# Altium project ADC_DAC2021.PrjPcb
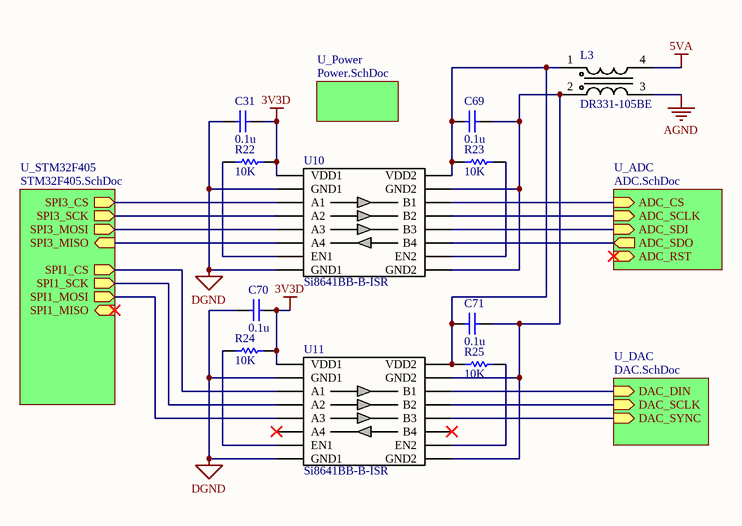
[diagram p0: top.SchDoc]
5 sheets, 182 parts. Net scope: hierarchical (ports join the sheet entries above them; power ports are global).
Board file: ADC_DAC.PcbDoc
Sheets:
  top.SchDoc
    U_ADC = ADC.SchDoc
    U_DAC = DAC.SchDoc
    U_Power = Power.SchDoc
    U_STM32F405 = STM32F405.SchDoc

## Sheet top.SchDoc
size A4

### Parts
C31  value 0.1u  [CAPC1608X90N]  (hidden comment: Cap)
C69  value 0.1u  [CAPC1608X90N]  (hidden comment: Cap)
C70  value 0.1u  [CAPC1608X90N]  (hidden comment: Cap)
C71  value 0.1u  [CAPC1608X90N]  (hidden comment: Cap)
L3  DR331-105BE  [DR331-105BE]
R22  value 10K  [RESC1608X55N]  (hidden comment: Res1)
R23  value 10K  [RESC1608X55N]  (hidden comment: Res1)
R24  value 10K  [RESC1608X55N]  (hidden comment: Res1)
R25  value 10K  [RESC1608X55N]  (hidden comment: Res1)
U10  Si8641BB-B-ISR  [SOIC127P600X175-16AN]
U11  Si8641BB-B-ISR  [SOIC127P600X175-16AN]

### Sub-sheets
U_ADC = ADC.SchDoc: ADC_SCLK (in), ADC_SDO (out), ADC_CS (in), ADC_SDI (in), ADC_RST (in)
U_DAC = DAC.SchDoc: DAC_SYNC (in), DAC_SCLK (in), DAC_DIN (in)
U_Power = Power.SchDoc: no entries
U_STM32F405 = STM32F405.SchDoc: SPI3_MOSI (out), SPI3_MISO (in), SPI3_SCK (out), SPI1_MOSI (out), SPI1_MISO (in), SPI1_SCK (out), SPI1_CS (out), SPI3_CS (out)

### Nets
3V3D: C31.1 C70.1 R22.2 R24.2 U10.1(VDD1) U11.1(VDD1)
5VA: L3.4(VOUT+)
AGND: L3.3(VOUT+)
DGND: C31.2 C70.2 U10.2(GND1) U10.8(GND1) U11.2(GND1) U11.8(GND1)
DAC_DIN: U11.14(B1) ; sheet U_DAC/DAC_DIN
DAC_SCLK: U11.13(B2) ; sheet U_DAC/DAC_SCLK
DAC_SYNC: U11.12(B3) ; sheet U_DAC/DAC_SYNC
SPI1_CS: U11.3(A1) ; sheet U_STM32F405/SPI1_CS
SPI1_MOSI: U11.5(A3) ; sheet U_STM32F405/SPI1_MOSI
SPI1_SCK: U11.4(A2) ; sheet U_STM32F405/SPI1_SCK
SPI3_CS: U10.3(A1) ; sheet U_STM32F405/SPI3_CS
SPI3_MISO: U10.6(A4) ; sheet U_STM32F405/SPI3_MISO
SPI3_MOSI: U10.5(A3) ; sheet U_STM32F405/SPI3_MOSI
SPI3_SCK: U10.4(A2) ; sheet U_STM32F405/SPI3_SCK
NetC69_1: C69.1 C71.2 L3.1(VOUT+) R23.1 R25.1 U10.16(VDD2) U11.16(VDD2)
NetC69_2: C69.2 C71.1 L3.2(VOUT+) U10.9(GND2) U10.15(GND2) U11.9(GND2) U11.15(GND2)
NetR22_1: R22.1 U10.7(EN1)
NetR23_2: R23.2 U10.10(EN2)
NetR24_1: R24.1 U11.7(EN1)
NetR25_2: R25.2 U11.10(EN2)
NetU6_1: U10.12(B3) ; sheet U_ADC/ADC_SDI
NetU6_36: U10.11(B4) ; sheet U_ADC/ADC_SDO
NetU6_37: U10.13(B2) ; sheet U_ADC/ADC_SCLK
NetU6_38: U10.14(B1) ; sheet U_ADC/ADC_CS

Not connected (* = marked no-connect by the designer): U11 6(A4)* 11(B4)*

### Library data of the parts
C31 C69-C71 = Cap: Capacitor; Published: 8-Jun-2000; LatestRevisionDate: 17-Jul-2002; LatestRevisionNote: Re-released for DXP Platform.; PackageReference: RAD-0.3; Publisher: Altium Limited; PackageDescription: Radial Cap, Thru-Hole; 2 Leads; 0.3 in Pin Spacing
L3 = DR331-105BE: Common mode choke 1mH 0.5A
R22-R25 = Res1: Resistor; Published: 8-Jun-2000; LatestRevisionDate: 17-Jul-2002; LatestRevisionNote: Re-released for DXP Platform.; PackageReference: AXIAL-0.3; Publisher: Altium Limited; PackageDescription: Axial Device, Thru-Hole; 2 Leads; 0.3 in Pin Spacing
U10 U11 = Si8641BB-B-ISR: isolator for SPI 3 forward 1 reverse isolator

## Sheet ADC.SchDoc
size A4
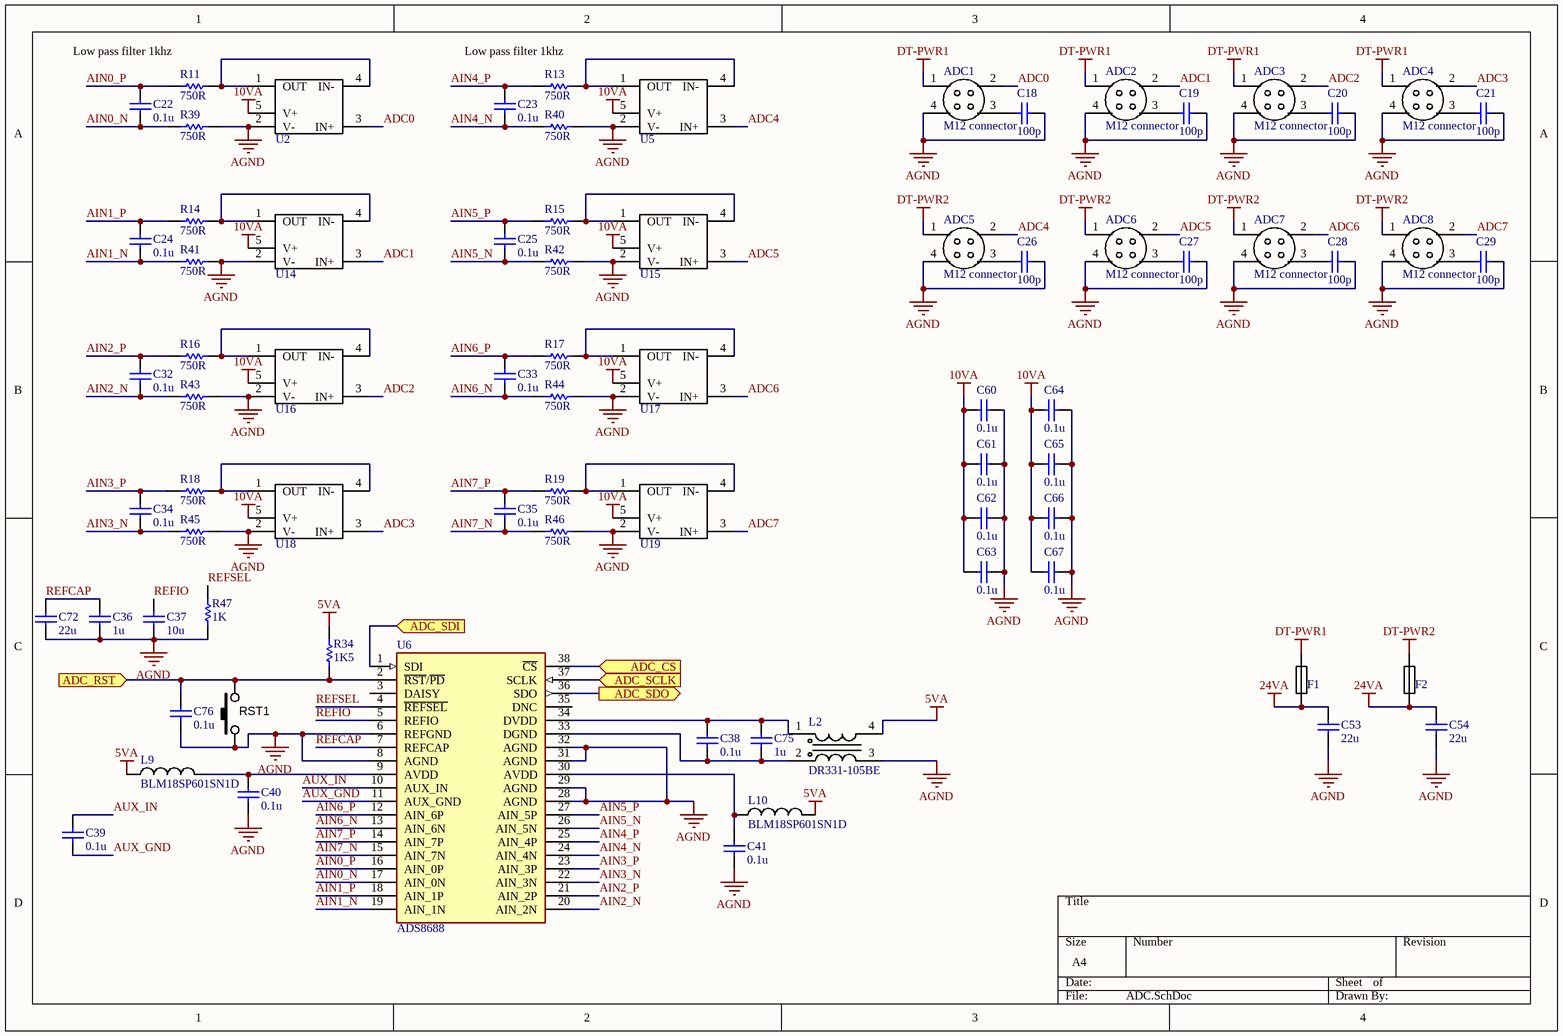
[diagram p1: ADC.SchDoc]

### Parts
ADC1  M12 connector  [GX12_PCB_Mount]
ADC2  M12 connector  [GX12_PCB_Mount]
ADC3  M12 connector  [GX12_PCB_Mount]
ADC4  M12 connector  [GX12_PCB_Mount]
ADC5  M12 connector  [GX12_PCB_Mount]
ADC6  M12 connector  [GX12_PCB_Mount]
ADC7  M12 connector  [GX12_PCB_Mount]
ADC8  M12 connector  [GX12_PCB_Mount]
C18  value 100p  [CAPC1608X90N]  (hidden comment: Cap)
C19  value 100p  [CAPC1608X90N]  (hidden comment: Cap)
C20  value 100p  [CAPC1608X90N]  (hidden comment: Cap)
C21  value 100p  [CAPC1608X90N]  (hidden comment: Cap)
C22  value 0.1u  [CAPC1608X90N]  (hidden comment: Cap)
C23  value 0.1u  [CAPC1608X90N]  (hidden comment: Cap)
C24  value 0.1u  [CAPC1608X90N]  (hidden comment: Cap)
C25  value 0.1u  [CAPC1608X90N]  (hidden comment: Cap)
C26  value 100p  [CAPC1608X90N]  (hidden comment: Cap)
C27  value 100p  [CAPC1608X90N]  (hidden comment: Cap)
C28  value 100p  [CAPC1608X90N]  (hidden comment: Cap)
C29  value 100p  [CAPC1608X90N]  (hidden comment: Cap)
C32  value 0.1u  [CAPC1608X90N]  (hidden comment: Cap)
C33  value 0.1u  [CAPC1608X90N]  (hidden comment: Cap)
C34  value 0.1u  [CAPC1608X90N]  (hidden comment: Cap)
C35  value 0.1u  [CAPC1608X90N]  (hidden comment: Cap)
C36  value 1u  [CAPC1608X90N]  (hidden comment: Cap)
C37  value 10u  [CAPC1608X90N]  (hidden comment: Cap)
C38  value 0.1u  [CAPC1608X90N]  (hidden comment: Cap)
C39  value 0.1u  [CAPC1608X90N]  (hidden comment: Cap)
C40  value 0.1u  [CAPC1608X90N]  (hidden comment: Cap)
C41  value 0.1u  [CAPC1608X90N]  (hidden comment: Cap)
C53  value 22u  [CAPC2012X135N]  (hidden comment: Cap)
C54  value 22u  [CAPC2012X135N]  (hidden comment: Cap)
C60  value 0.1u  [CAPC1608X90N]  (hidden comment: Cap)
C61  value 0.1u  [CAPC1608X90N]  (hidden comment: Cap)
C62  value 0.1u  [CAPC1608X90N]  (hidden comment: Cap)
C63  value 0.1u  [CAPC1608X90N]  (hidden comment: Cap)
C64  value 0.1u  [CAPC1608X90N]  (hidden comment: Cap)
C65  value 0.1u  [CAPC1608X90N]  (hidden comment: Cap)
C66  value 0.1u  [CAPC1608X90N]  (hidden comment: Cap)
C67  value 0.1u  [CAPC1608X90N]  (hidden comment: Cap)
C72  value 22u  [CAPC2012X135N]  (hidden comment: Cap)
C75  value 1u  [CAPC1608X90N]  (hidden comment: Cap)
C76  value 0.1u  [CAPC1608X90N]  (hidden comment: Cap)
F1  MFU0805FF00500P100  [RESC2012X70N]  (value not drawn)
F2  MFU0805FF00500P100  [RESC2012X70N]  (value not drawn)
L2  DR331-105BE  [DR331-105BE]
L9  BLM18SP601SN1D  [INDC1608N]
L10  BLM18SP601SN1D  [INDC1608N]
R11  value 750R  [RESC1608X55N]  (hidden comment: Res1)
R13  value 750R  [RESC1608X55N]  (hidden comment: Res1)
R14  value 750R  [RESC1608X55N]  (hidden comment: Res1)
R15  value 750R  [RESC1608X55N]  (hidden comment: Res1)
R16  value 750R  [RESC1608X55N]  (hidden comment: Res1)
R17  value 750R  [RESC1608X55N]  (hidden comment: Res1)
R18  value 750R  [RESC1608X55N]  (hidden comment: Res1)
R19  value 750R  [RESC1608X55N]  (hidden comment: Res1)
R34  value 1K5  [RESC1608X55N]  (hidden comment: Res1)
R39  value 750R  [RESC1608X55N]  (hidden comment: Res1)
R40  value 750R  [RESC1608X55N]  (hidden comment: Res1)
R41  value 750R  [RESC1608X55N]  (hidden comment: Res1)
R42  value 750R  [RESC1608X55N]  (hidden comment: Res1)
R43  value 750R  [RESC1608X55N]  (hidden comment: Res1)
R44  value 750R  [RESC1608X55N]  (hidden comment: Res1)
R45  value 750R  [RESC1608X55N]  (hidden comment: Res1)
R46  value 750R  [RESC1608X55N]  (hidden comment: Res1)
R47  value 1K  [RESC1608X55N]  (hidden comment: Res1)
RST1  SW_THT_PB_4.3mm  [TACT_SWT-SMD-4.4]  (value not drawn)
U2  OPA196  [SOT23-5]  (value not drawn)
U5  OPA196  [SOT23-5]  (value not drawn)
U6  ADS8688  [TSSOP38]
U14  OPA196  [SOT23-5]  (value not drawn)
U15  OPA196  [SOT23-5]  (value not drawn)
U16  OPA196  [SOT23-5]  (value not drawn)
U17  OPA196  [SOT23-5]  (value not drawn)
U18  OPA196  [SOT23-5]  (value not drawn)
U19  OPA196  [SOT23-5]  (value not drawn)

### Ports
ADC_CS (in), ADC_RST (in), ADC_SCLK (in), ADC_SDI (in), ADC_SDO (out)

### Nets
5VA: L2.4(VOUT+) L9.1 L10.2 R34.2
10VA: C60.2 C61.2 C62.2 C63.2 C64.2 C65.2 C66.2 C67.2 U2.5(V+) U5.5(V+) U14.5(V+) U15.5(V+) U16.5(V+) U17.5(V+) U18.5(V+) U19.5(V+)
24VA: C53.2 C54.2 F1.1 F2.1
AGND: ADC1.4 ADC2.4 ADC3.4 ADC4.4 ADC5.4 ADC6.4 ADC7.4 ADC8.4 C18.1 C19.1 C20.1 C21.1 C26.1 C27.1 C28.1 C29.1 C36.1 C37.1 C40.1 C41.1 C53.1 C54.1 C60.1 C61.1 C62.1 C63.1 C64.1 C65.1 C66.1 C67.1 C72.1 C76.2 L2.3(VOUT+) R39.2 R40.2 R41.2 R42.2 R43.2 R44.2 R45.2 R46.2 R47.1 RST1.1 U2.2(V-) U5.2(V-) U6.6(REFGND) U6.8(AGND) U6.28(AGND) U6.29(AGND) U6.31(AGND) U6.32(AGND) U14.2(V-) U15.2(V-) U16.2(V-) U17.2(V-) U18.2(V-) U19.2(V-)
DT-PWR1: ADC1.1 ADC2.1 ADC3.1 ADC4.1 F1.2
DT-PWR2: ADC5.1 ADC6.1 ADC7.1 ADC8.1 F2.2
ADC0: ADC1.2 U2.3(IN+)
ADC1: ADC2.2 U14.3(IN+)
ADC2: ADC3.2 U16.3(IN+)
ADC3: ADC4.2 U18.3(IN+)
ADC4: ADC5.2 U5.3(IN+)
ADC5: ADC6.2 U15.3(IN+)
ADC6: ADC7.2 U17.3(IN+)
ADC7: ADC8.2 U19.3(IN+)
AIN0_N: C22.1 R39.1 U6.17(AIN_0N)
AIN0_P: C22.2 R11.1 U6.16(AIN_0P)
AIN1_N: C24.1 R41.1 U6.19(AIN_1N)
AIN1_P: C24.2 R14.1 U6.18(AIN_1P)
AIN2_N: C32.1 R43.1 U6.20(AIN_2N)
AIN2_P: C32.2 R16.1 U6.21(AIN_2P)
AIN3_N: C34.1 R45.1 U6.22(AIN_3N)
AIN3_P: C34.2 R18.1 U6.23(AIN_3P)
AIN4_N: C23.1 R40.1 U6.24(AIN_4N)
AIN4_P: C23.2 R13.1 U6.25(AIN_4P)
AIN5_N: C25.1 R42.1 U6.26(AIN_5N)
AIN5_P: C25.2 R15.1 U6.27(AIN_5P)
AIN6_N: C33.1 R44.1 U6.13(AIN_6N)
AIN6_P: C33.2 R17.1 U6.12(AIN_6P)
AIN7_N: C35.1 R46.1 U6.15(AIN_7N)
AIN7_P: C35.2 R19.1 U6.14(AIN_7P)
AUX_GND: C39.1 U6.11(AUX_GND)
AUX_IN: C39.2 U6.10(AUX_IN)
REFCAP: C36.2 C72.2 U6.7(REFCAP)
REFIO: C37.2 U6.5(REFIO)
REFSEL: R47.2 U6.4(~{REFSEL})
NetADC1_3: ADC1.3 C18.2
NetADC2_3: ADC2.3 C19.2
NetADC3_3: ADC3.3 C20.2
NetADC4_3: ADC4.3 C21.2
NetADC5_3: ADC5.3 C26.2
NetADC6_3: ADC6.3 C27.2
NetADC7_3: ADC7.3 C28.2
NetADC8_3: ADC8.3 C29.2
NetC38_1: C38.1 C75.1 L2.2(VOUT+) U6.33(DGND)
NetC38_2: C38.2 C75.2 L2.1(VOUT+) U6.34(DVDD)
NetC40_2: C40.2 L9.2 U6.9(AVDD)
NetC41_2: C41.2 L10.1 U6.30(AVDD)
NetC76_1: C76.1 R34.1 RST1.2 U6.2(~{RST}/~{PD}) ; port ADC_RST
NetR11_2: R11.2 U2.1(OUT) U2.4(IN-)
NetR13_2: R13.2 U5.1(OUT) U5.4(IN-)
NetR14_2: R14.2 U14.1(OUT) U14.4(IN-)
NetR15_2: R15.2 U15.1(OUT) U15.4(IN-)
NetR16_2: R16.2 U16.1(OUT) U16.4(IN-)
NetR17_2: R17.2 U17.1(OUT) U17.4(IN-)
NetR18_2: R18.2 U18.1(OUT) U18.4(IN-)
NetR19_2: R19.2 U19.1(OUT) U19.4(IN-)
NetU6_1: U6.1(SDI) ; port ADC_SDI
NetU6_36: U6.36(SDO) ; port ADC_SDO
NetU6_37: U6.37(SCLK) ; port ADC_SCLK
NetU6_38: U6.38(~{CS}) ; port ADC_CS

Not connected (* = marked no-connect by the designer): U6 3(DAISY) 35(DNC)

### Notes on the sheet
- Low pass filter 1khz

### Library data of the parts
ADC1-ADC8 = M12_connector: M12 connect with 4 pin, current 4A per terminal; ComponentLink1Description: Purchase; ComponentLink1URL: https://item.taobao.com/item.htm?spm=a230r.1.14.42.72f34373kzOCRP&id=571188244354&ns=1&abbucket=18#detail
C18-C29 C32-C41 C53 C54 C60-C67 C72 C75 C76 = Cap: Capacitor; Published: 8-Jun-2000; LatestRevisionDate: 17-Jul-2002; LatestRevisionNote: Re-released for DXP Platform.; PackageReference: RAD-0.3; Publisher: Altium Limited; PackageDescription: Radial Cap, Thru-Hole; 2 Leads; 0.3 in Pin Spacing
F1 F2 = FUSE_32V_500MA_0805: fuse 32V 0.5A
L2 = DR331-105BE: Common mode choke 1mH 0.5A
L9 L10 = INC_BLM18SP601SN1D: Ferritebead 1.5A, max 600ohm resistance
R11 R13-R19 R34 R39-R47 = Res1: Resistor; Published: 8-Jun-2000; LatestRevisionDate: 17-Jul-2002; LatestRevisionNote: Re-released for DXP Platform.; PackageReference: AXIAL-0.3; Publisher: Altium Limited; PackageDescription: Axial Device, Thru-Hole; 2 Leads; 0.3 in Pin Spacing
RST1 = SW_THT_PB_4.3mm: Switch, tact, 4.3mm stem; Manufacturer 1: Bond-Tact; Manufacturer Part Number 1: TS-1143-WP-300; SCDType: spec; Function: Speed; Package / Case: 6.5x6.5mm; 4.3mm stem; Material: Brass/Nylon/Ag plating
U2 U5 U14-U19 = OPA196: operational amplifier 36V input; Vs: -16 to +16 / 0 to 36V; Offset voltage: 100uV; Iout: -65 to 65mA; ComponentLink1Description: datasheet; ComponentLink1URL: https://www.ti.com/lit/ds/symlink/opa196.pdf?HQS=TI-null-null-mousermode-df-pf-null-wwe&DCM=yes&ref_url=https%3A%2F%2Fwww.mouser.hk%2F&distId=26
U6 = ADS8688: ADC 8 channel, 500KSPS

## Sheet DAC.SchDoc
size A4
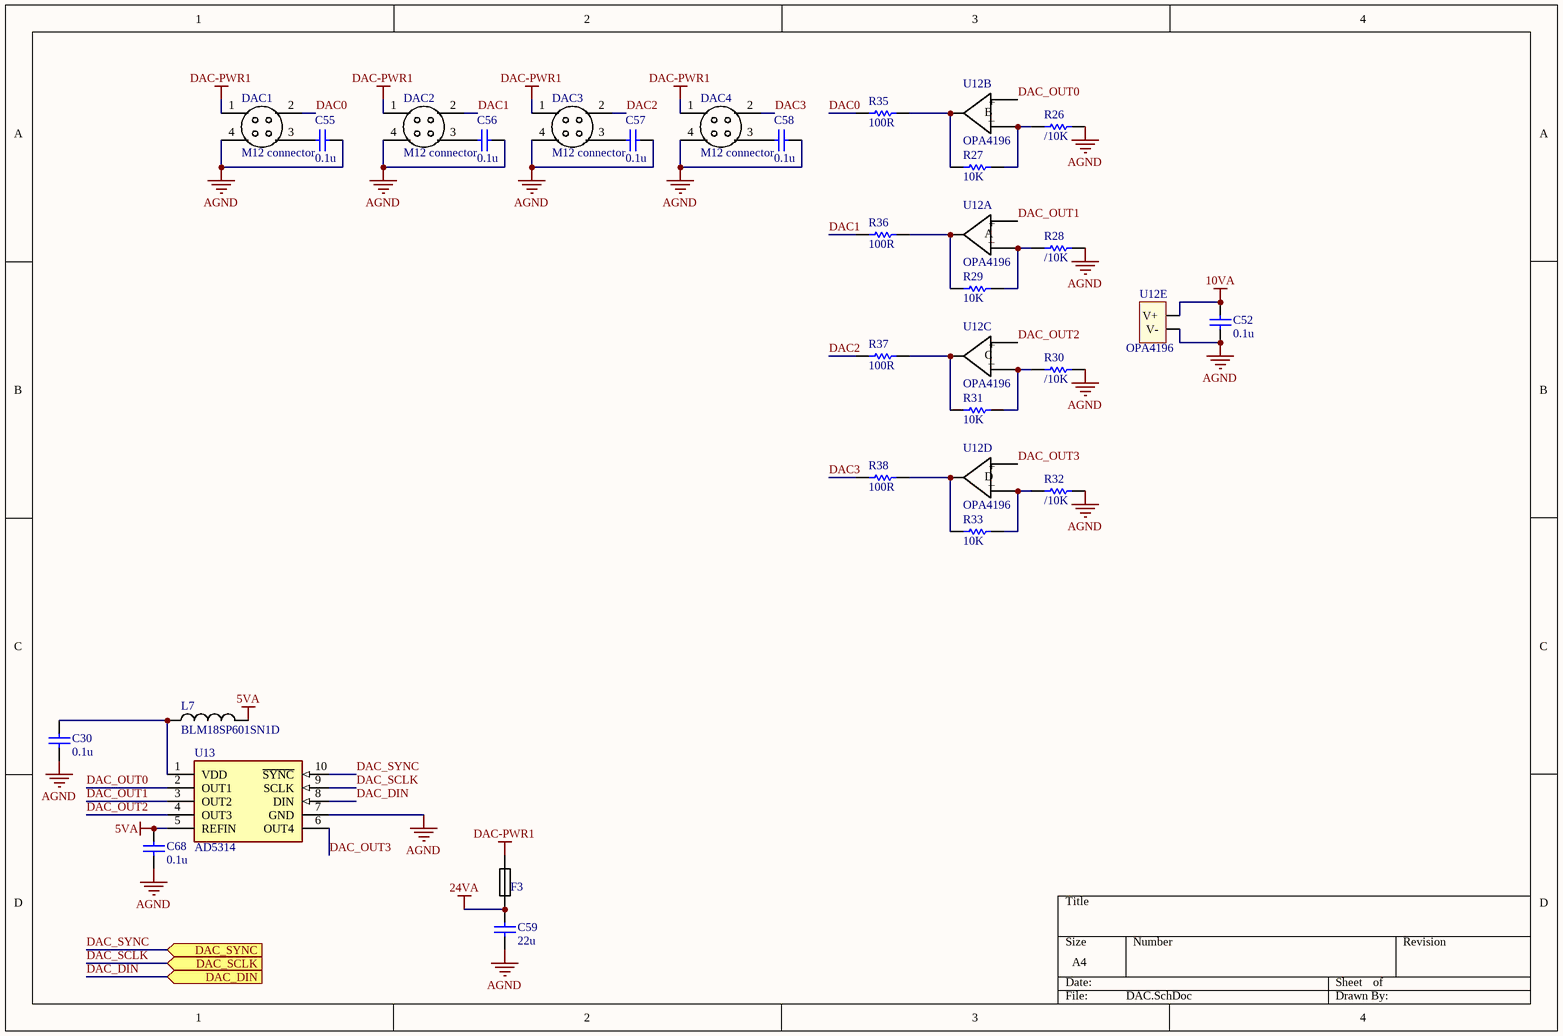
[diagram p2: DAC.SchDoc]

### Parts
C30  value 0.1u  [CAPC1608X90N]  (hidden comment: Cap)
C52  value 0.1u  [CAPC1608X90N]  (hidden comment: Cap)
C55  value 0.1u  [CAPC1608X90N]  (hidden comment: Cap)
C56  value 0.1u  [CAPC1608X90N]  (hidden comment: Cap)
C57  value 0.1u  [CAPC1608X90N]  (hidden comment: Cap)
C58  value 0.1u  [CAPC1608X90N]  (hidden comment: Cap)
C59  value 22u  [CAPC2012X135N]  (hidden comment: Cap)
C68  value 0.1u  [CAPC1608X90N]  (hidden comment: Cap)
DAC1  M12 connector  [GX12_PCB_Mount]
DAC2  M12 connector  [GX12_PCB_Mount]
DAC3  M12 connector  [GX12_PCB_Mount]
DAC4  M12 connector  [GX12_PCB_Mount]
F3  MFU0805FF00500P100  [RESC2012X70N]  (value not drawn)
L7  BLM18SP601SN1D  [INDC1608N]
R26  value /10K  [RESC1608X55N]  (hidden comment: Res1)
R27  value 10K  [RESC1608X55N]  (hidden comment: Res1)
R28  value /10K  [RESC1608X55N]  (hidden comment: Res1)
R29  value 10K  [RESC1608X55N]  (hidden comment: Res1)
R30  value /10K  [RESC1608X55N]  (hidden comment: Res1)
R31  value 10K  [RESC1608X55N]  (hidden comment: Res1)
R32  value /10K  [RESC1608X55N]  (hidden comment: Res1)
R33  value 10K  [RESC1608X55N]  (hidden comment: Res1)
R35  value 100R  [RESC1608X55N]  (hidden comment: Res1)
R36  value 100R  [RESC1608X55N]  (hidden comment: Res1)
R37  value 100R  [RESC1608X55N]  (hidden comment: Res1)
R38  value 100R  [RESC1608X55N]  (hidden comment: Res1)
U12  OPA4196  [SOIC127P600X175-14AN]  (parts A,B,C,D,E of 5)
U13  AD5314  [MSOP10_no_EP]

### Ports
DAC_DIN (in), DAC_SCLK (in), DAC_SYNC (in)

### Nets
5VA: C68.1 L7.1 U13.5(REFIN)
10VA: C52.1 U12.4(V+)
24VA: C59.2 F3.1
AGND: C30.2 C52.2 C55.1 C56.1 C57.1 C58.1 C59.1 C68.2 DAC1.4 DAC2.4 DAC3.4 DAC4.4 R26.2 R28.2 R30.2 R32.2 U12.11(V-) U13.7(GND)
DAC-PWR1: DAC1.1 DAC2.1 DAC3.1 DAC4.1 F3.2
DAC0: DAC1.2 R35.1
DAC1: DAC2.2 R36.1
DAC2: DAC3.2 R37.1
DAC3: DAC4.2 R38.1
DAC_DIN: U13.8(DIN) ; port DAC_DIN
DAC_OUT0: U12.5(INB+) U13.2(OUT1)
DAC_OUT1: U12.3(INA+) U13.3(OUT2)
DAC_OUT2: U12.10(INC+) U13.4(OUT3)
DAC_OUT3: U12.12(IND+) U13.6(OUT4)
DAC_SCLK: U13.9(SCLK) ; port DAC_SCLK
DAC_SYNC: U13.10(~{SYNC}) ; port DAC_SYNC
NetC30_1: C30.1 L7.2 U13.1(VDD)
NetC55_2: C55.2 DAC1.3
NetC56_2: C56.2 DAC2.3
NetC57_2: C57.2 DAC3.3
NetC58_2: C58.2 DAC4.3
NetR26_1: R26.1 R27.2 U12.6(INB-)
NetR27_1: R27.1 R35.2 U12.7(OUT_B)
NetR28_1: R28.1 R29.2 U12.2(INA-)
NetR29_1: R29.1 R36.2 U12.1(OUT_A)
NetR30_1: R30.1 R31.2 U12.9(INC-)
NetR31_1: R31.1 R37.2 U12.8(OUT_C)
NetR32_1: R32.1 R33.2 U12.13(IND-)
NetR33_1: R33.1 R38.2 U12.14(OUT_D)

### Notes on the sheet
- (in symbol OPA4196, part A) +; A; _
- (in symbol OPA4196, part B) +; B; _
- (in symbol OPA4196, part C) +; C; _
- (in symbol OPA4196, part D) +; D; _

### Library data of the parts
C30 C52 C55-C59 C68 = Cap: Capacitor; Published: 8-Jun-2000; LatestRevisionDate: 17-Jul-2002; LatestRevisionNote: Re-released for DXP Platform.; PackageReference: RAD-0.3; Publisher: Altium Limited; PackageDescription: Radial Cap, Thru-Hole; 2 Leads; 0.3 in Pin Spacing
DAC1-DAC4 = M12_connector: as ADC1 on sheet ADC; ComponentLink1Description: Purchase; ComponentLink1URL: https://item.taobao.com/item.htm?spm=a230r.1.14.42.72f34373kzOCRP&id=571188244354&ns=1&abbucket=18#detail
F3 = FUSE_32V_500MA_0805: fuse 32V 0.5A
L7 = INC_BLM18SP601SN1D: Ferritebead 1.5A, max 600ohm resistance
R26-R33 R35-R38 = Res1: Resistor; Published: 8-Jun-2000; LatestRevisionDate: 17-Jul-2002; LatestRevisionNote: Re-released for DXP Platform.; PackageReference: AXIAL-0.3; Publisher: Altium Limited; PackageDescription: Axial Device, Thru-Hole; 2 Leads; 0.3 in Pin Spacing
U12 = OPA4196: operational amplifier 36V input
U13 = AD5314: 10-bit DAC 4 channel

## Sheet Power.SchDoc
size A4
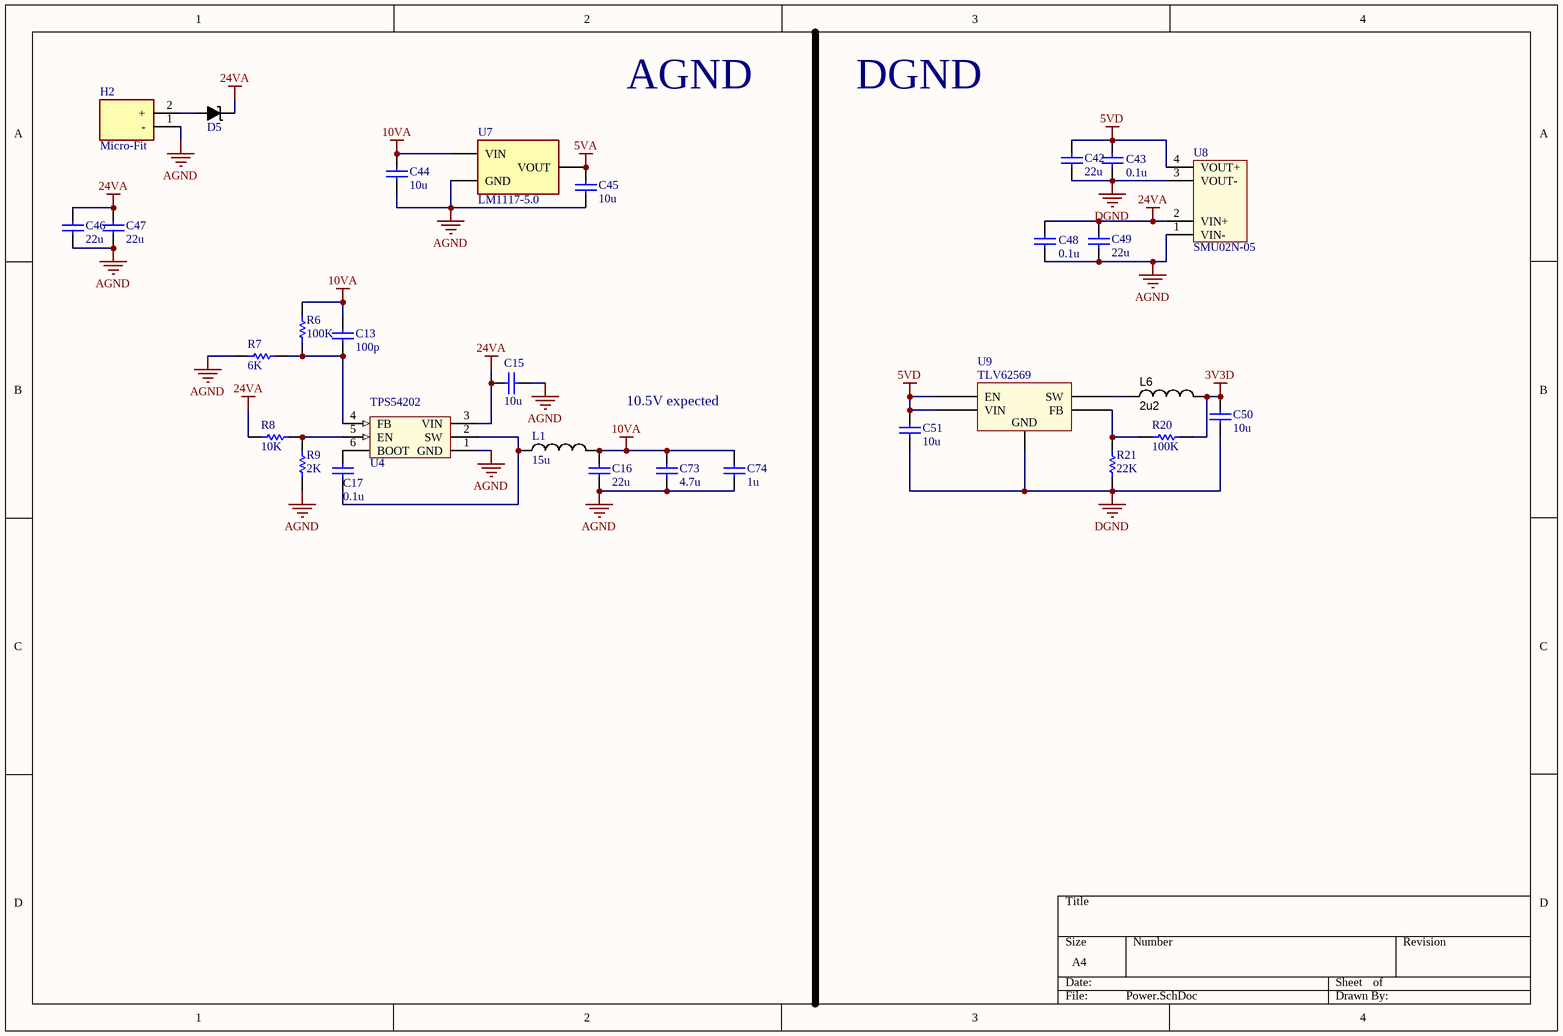
[diagram p3: Power.SchDoc]

### Parts
C13  value 100p  [CAPC1608X90N]  (hidden comment: Cap)
C15  value 10u  [CAPC2012X135N]  (hidden comment: Cap)
C16  value 22u  [CAPC2012X135N]  (hidden comment: Cap)
C17  value 0.1u  [CAPC1608X90N]  (hidden comment: Cap)
C42  value 22u  [CAPC2012X135N]  (hidden comment: Cap)
C43  value 0.1u  [CAPC1608X90N]  (hidden comment: Cap)
C44  value 10u  [CAPC2012X135N]  (hidden comment: Cap)
C45  value 10u  [CAPC2012X135N]  (hidden comment: Cap)
C46  value 22u  [CAPC2012X135N]  (hidden comment: Cap)
C47  value 22u  [CAPC2012X135N]  (hidden comment: Cap)
C48  value 0.1u  [CAPC1608X90N]  (hidden comment: Cap)
C49  value 22u  [CAPC2012X135N]  (hidden comment: Cap)
C50  value 10u  [CAPC2012X135N]  (hidden comment: Cap)
C51  value 10u  [CAPC2012X135N]  (hidden comment: Cap)
C73  value 4.7u  [CAPC1608X90N]  (hidden comment: Cap)
C74  value 1u  [CAPC1608X90N]  (hidden comment: Cap)
D5  SS24  [DO-214AA]  (value not drawn)
H2  Micro-Fit  [430450212]
L1  value 15u  [INDC_5.5x5.3x3]  (hidden comment: 15uH inductor)
L6  value 2u2  [INDM3225X240N]  (hidden comment: inductor)
R6  value 100K  [RESC1608X55N]  (hidden comment: Res1)
R7  value 6K  [RESC1608X55N]  (hidden comment: Res1)
R8  value 10K  [RESC1608X55N]  (hidden comment: Res1)
R9  value 2K  [RESC1608X55N]  (hidden comment: Res1)
R20  value 100K  [RESC2012X70N]  (hidden comment: Res1)
R21  value 22K  [RESC2012X70N]  (hidden comment: Res1)
U4  TPS54202  [SOT23-6]
U7  LM1117-5.0  [SOT223]
U8  SMU02N-05  [SMU02N]
U9  TLV62569  [SOT23-5]

### Nets
3V3D: C50.2 L6.2 R20.1
5VA: C45.2 U7.2(VOUT) U7.4(VOUT)
5VD: C42.2 C43.2 C51.2 U8.4(VOUT+) U9.1(EN) U9.4(VIN)
10VA: C13.2 C16.2 C44.2 C73.2 C74.2 L1.2 R6.2 U7.3(VIN)
24VA: C15.1 C46.2 C47.2 C48.2 C49.2 D5.K(Cathode) R8.1 U4.3(VIN) U8.2(VIN+)
AGND: C15.2 C16.1 C44.1 C45.1 C46.1 C47.1 C48.1 C49.1 C73.1 C74.1 H2.1(-) R7.2 R9.1 U4.1(GND) U7.1(GND) U8.1(VIN-)
DGND: C42.1 C43.1 C50.1 C51.1 R21.2 U8.3(VOUT-) U9.2(GND)
NetC13_1: C13.1 R6.1 R7.1 U4.4(FB)
NetC17_1: C17.1 L1.1 U4.2(SW)
NetC17_2: C17.2 U4.6(BOOT)
NetD5_A: D5.A(Anode) H2.2(+)
NetL6_1: L6.1 U9.3(SW)
NetR8_2: R8.2 R9.2 U4.5(EN)
NetR20_2: R20.2 R21.1 U9.5(FB)

### Notes on the sheet
- AGND
- DGND
- 10.5V expected

### Library data of the parts
C13 C15-C17 C42-C51 C73 C74 = Cap: Capacitor; Published: 8-Jun-2000; LatestRevisionDate: 17-Jul-2002; LatestRevisionNote: Re-released for DXP Platform.; PackageReference: RAD-0.3; Publisher: Altium Limited; PackageDescription: Radial Cap, Thru-Hole; 2 Leads; 0.3 in Pin Spacing
D5 = SS24: 2.0A SURFACE MOUNT SCHOTTKY BARRIER RECTIFIER; Voltage: 40V; Current: 2A
H2 = Molex_430450212: Micro fit series from MOLEX. 2P. 8.6A
L1 = INDC_MPX1D0530L150: 15uH inductor with 2A saturation current. Dimension is 5.5 * 5.2 * 3 mm^3; Saturation Current: 2A
L6 = INDC: IHLP SMD 4040; link: http://www.mouser.hk/ProductDetail/Panasonic/ETQ-P5M4R7YFC/?qs=sGAEpiMZZMsg%252by3WlYCkUx1BJssUTVH58rrEHsPkNus%3d
R6-R9 R20 R21 = Res1: Resistor; Published: 8-Jun-2000; LatestRevisionDate: 17-Jul-2002; LatestRevisionNote: Re-released for DXP Platform.; PackageReference: AXIAL-0.3; Publisher: Altium Limited; PackageDescription: Axial Device, Thru-Hole; 2 Leads; 0.3 in Pin Spacing
U4 = TPS54202: 4.5-28V input 2A output step down, EMI Friendly Synchronous Step Down Converter; Vin(max): 28V; Vin(min): 4.5V; Currrent: 2A
U7 = LM1117-5.0: 1117 LDO with fixed 5V output, 800mA current
U8 = SMU02N-05: isolated 24V to 5V
U9 = TLV62569: 2-A High Efficiency Synchronous Buck Converter in SOT Package; Manufacturer: TI; Vin: 2.5-5.5V; Iout(max): 2A

## Sheet STM32F405.SchDoc
size A4
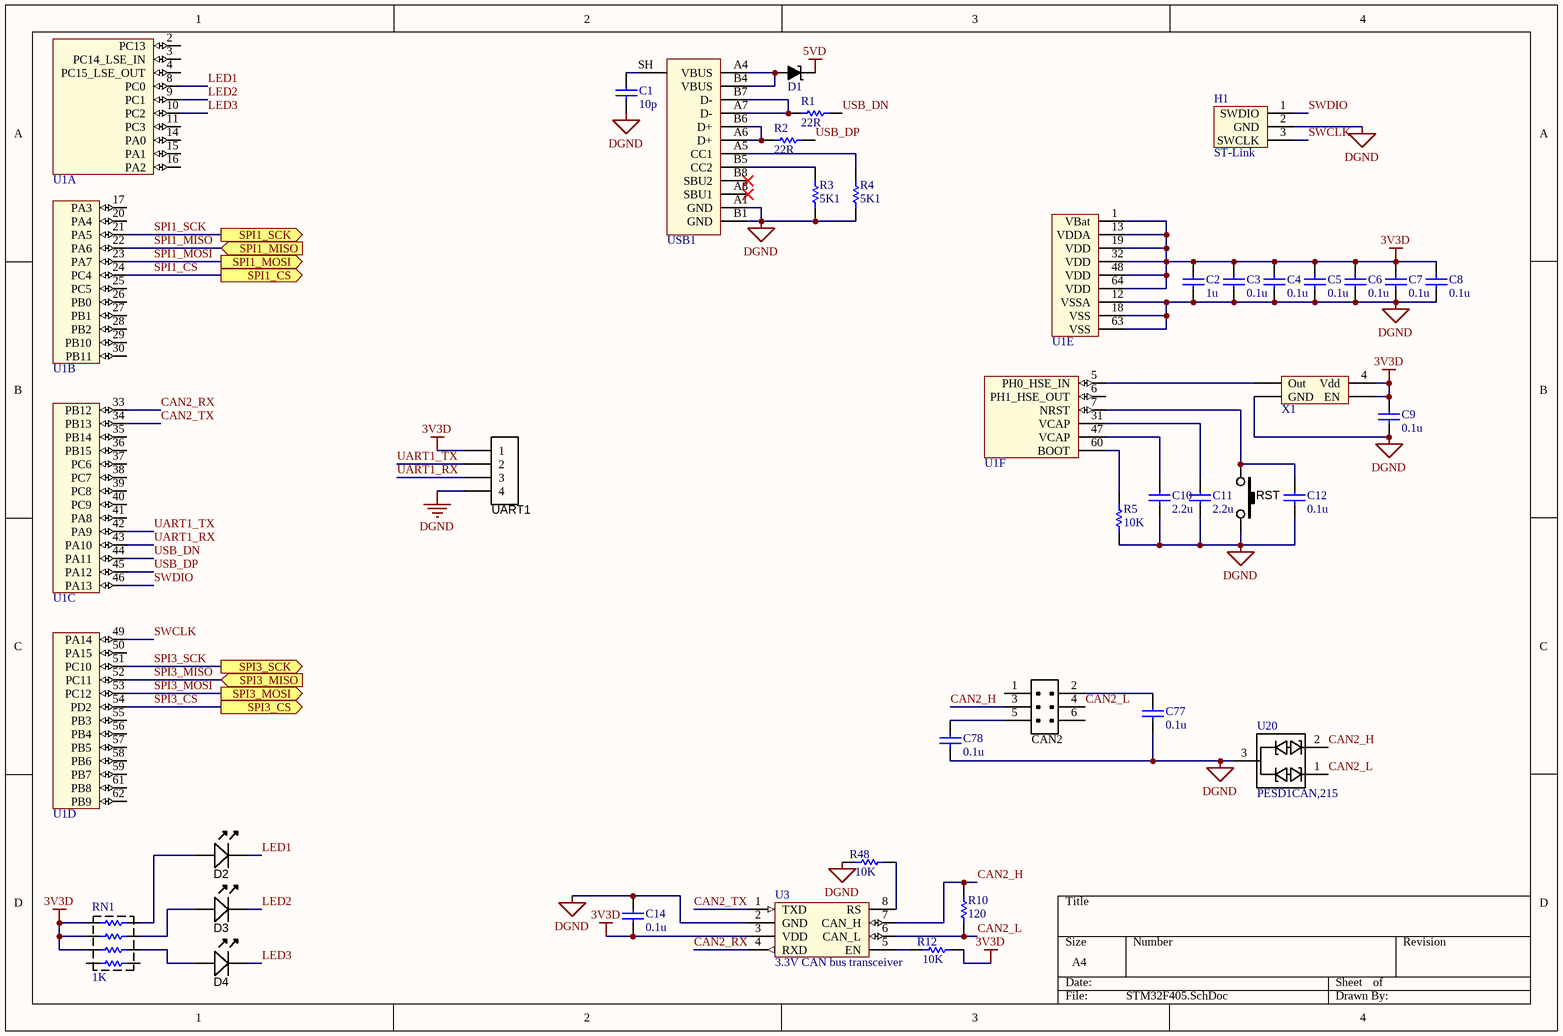
[diagram p4: STM32F405.SchDoc]

### Parts
C1  value 10p  [CAPC1608X90N]  (hidden comment: Cap)
C2  value 1u  [CAPC1608X90N]  (hidden comment: Cap)
C3  value 0.1u  [CAPC1608X90N]  (hidden comment: Cap)
C4  value 0.1u  [CAPC1608X90N]  (hidden comment: Cap)
C5  value 0.1u  [CAPC1608X90N]  (hidden comment: Cap)
C6  value 0.1u  [CAPC1608X90N]  (hidden comment: Cap)
C7  value 0.1u  [CAPC1608X90N]  (hidden comment: Cap)
C8  value 0.1u  [CAPC1608X90N]  (hidden comment: Cap)
C9  value 0.1u  [CAPC1608X90N]  (hidden comment: Cap)
C10  value 2.2u  [CAPC1608X90N]  (hidden comment: Cap)
C11  value 2.2u  [CAPC1608X90N]  (hidden comment: Cap)
C12  value 0.1u  [CAPC1608X90N]  (hidden comment: Cap)
C14  value 0.1u  [CAPC1608X90N]  (hidden comment: Cap)
C77  value 0.1u  [CAPC1608X90N]  (hidden comment: Cap)
C78  value 0.1u  [CAPC1608X90N]  (hidden comment: Cap)
CAN2  Header, 2x3-pin  [HDR2X3_2.54MMP_RA]  (value not drawn)
D1  diode  [DIODE_3216_70N]  (value not drawn)
D2  LED_Green_GullWing  [LED-0805-A]  (value not drawn)
D3  LED_Green_GullWing  [LED-0805-A]  (value not drawn)
D4  LED_Green_GullWing  [LED-0805-A]  (value not drawn)
H1  ST-Link  [ST-Link]
R1  value 22R  [RESC1608X55N]  (hidden comment: Res1)
R2  value 22R  [RESC1608X55N]  (hidden comment: Res1)
R3  value 5K1  [RESC1608X55N]  (hidden comment: Res1)
R4  value 5K1  [RESC1608X55N]  (hidden comment: Res1)
R5  value 10K  [RESC1608X55N]  (hidden comment: Res1)
R10  value 120  [RESC1608X55N]  (hidden comment: Res1)
R12  value 10K  [RESC1608X55N]  (hidden comment: Res1)
R48  value 10K  [RESC1608X55N]  (hidden comment: Res1)
RN1  value 1K  [RESCAXS50P160X320X70-8N]  (hidden comment: resistor network)
RST  SW_THT_PB_4.3mm  [TACT_SWT-SMD-4.4]  (value not drawn)
U1  STM32F405RE  [LQFP64]  (value not drawn)  (parts A,B,C,D,E,F of 6)
U3  3.3V CAN bus transceiver  [SOIC127P600X175-8AN]
U20  PESD1CAN,215  [SOT23-3]
UART1  Programmer  [HDR1X4_2.54MMP]  (value not drawn)  (no BOM)
USB1  USB type C connector  [TYPE-C-31-M-12]  (value not drawn)
X1  ASE-8.000MHZ-LC-T  [ASE Series]  (value not drawn)

### Ports
SPI1_CS (out), SPI1_MISO (in), SPI1_MOSI (out), SPI1_SCK (out), SPI3_CS (out), SPI3_MISO (in), SPI3_MOSI (out), SPI3_SCK (out)

### Nets
3V3D: C2.2 C3.2 C4.2 C5.2 C6.2 C7.2 C8.2 C9.2 C14.1 R12.1 RN1.1 RN1.2 RN1.3 U1.1(VBat) U1.13(VDDA) U1.19(VDD) U1.32(VDD) U1.48(VDD) U1.64(VDD) U3.3(VDD) UART1.1 X1.1(EN) X1.4(Vdd)
5VD: D1.K(Cathode)
DGND: C1.1 C2.1 C3.1 C4.1 C5.1 C6.1 C7.1 C8.1 C9.1 C10.1 C11.1 C12.1 C14.2 C77.2 C78.1 H1.2(GND) R3.1 R4.1 R5.1 R48.2 RST.2 U1.12(VSSA) U1.18(VSS) U1.63(VSS) U3.2(GND) U20.3 UART1.4 USB1.A1(GND) USB1.B1(GND) X1.2(GND)
CAN2_H: CAN2.3 R10.2 U3.7(CAN_H) U20.2
CAN2_L: CAN2.4 R10.1 U3.6(CAN_L) U20.1
CAN2_RX: U1.33(PB12) U3.4(RXD)
CAN2_TX: U1.34(PB13) U3.1(TXD)
LED1: D2.K U1.8(PC0)
LED2: D3.K U1.9(PC1)
LED3: D4.K U1.10(PC2)
SPI1_CS: U1.24(PC4) ; port SPI1_CS
SPI1_MISO: U1.22(PA6) ; port SPI1_MISO
SPI1_MOSI: U1.23(PA7) ; port SPI1_MOSI
SPI1_SCK: U1.21(PA5) ; port SPI1_SCK
SPI3_CS: U1.54(PD2) ; port SPI3_CS
SPI3_MISO: U1.52(PC11) ; port SPI3_MISO
SPI3_MOSI: U1.53(PC12) ; port SPI3_MOSI
SPI3_SCK: U1.51(PC10) ; port SPI3_SCK
SWCLK: H1.3(SWCLK) U1.49(PA14)
SWDIO: H1.1(SWDIO) U1.46(PA13)
UART1_RX: U1.43(PA10) UART1.3
UART1_TX: U1.42(PA9) UART1.2
USB_DN: R1.2 U1.44(PA11)
USB_DP: R2.2 U1.45(PA12)
NetC1_2: C1.2 USB1.SH
NetC10_2: C10.2 U1.47(VCAP)
NetC11_2: C11.2 U1.31(VCAP)
NetC12_2: C12.2 RST.1 U1.7(NRST)
NetC77_1: C77.1 CAN2.2
NetC78_2: C78.2 CAN2.5
NetD1_A: D1.A(Anode) USB1.A4(VBUS) USB1.B4(VBUS)
NetD2_A: D2.A RN1.8
NetD3_A: D3.A RN1.7
NetD4_A: D4.A RN1.6
NetR1_1: R1.1 USB1.A7(D-) USB1.B7(D-)
NetR2_1: R2.1 USB1.A6(D+) USB1.B6(D+)
NetR3_2: R3.2 USB1.B5(CC2)
NetR4_2: R4.2 USB1.A5(CC1)
NetR5_2: R5.2 U1.60(BOOT)
NetR12_2: R12.2 U3.5(EN)
NetR48_1: R48.1 U3.8(RS)
NetU1_5: U1.5(PH0_HSE_IN) X1.3(Out)

Not connected (* = marked no-connect by the designer): CAN2 1 6; RN1 4 5; U1 2(PC13) 3(PC14_LSE_IN) 4(PC15_LSE_OUT) 6(PH1_HSE_OUT) 11(PC3) 14(PA0) 15(PA1) 16(PA2) 17(PA3) 20(PA4) 25(PC5) 26(PB0) 27(PB1) 28(PB2) 29(PB10) 30(PB11) 35(PB14) 36(PB15) 37(PC6) 38(PC7) 39(PC8) 40(PC9) 41(PA8) 50(PA15) 55(PB3) 56(PB4) 57(PB5) 58(PB6) 59(PB7) 61(PB8) 62(PB9); USB1 A8(SBU1)* B8(SBU2)*

### Library data of the parts
C1-C12 C14 C77 C78 = Cap: Capacitor; Published: 8-Jun-2000; LatestRevisionDate: 17-Jul-2002; LatestRevisionNote: Re-released for DXP Platform.; PackageReference: RAD-0.3; Publisher: Altium Limited; PackageDescription: Radial Cap, Thru-Hole; 2 Leads; 0.3 in Pin Spacing
CAN2 = Header_2x3P
D1 = SD1206S040S2R0: 40V 2A; ComponentLink1Description: mouser; ComponentLink1URL: https://www.mouser.hk/ProductDetail/AVX/SD1206S040S2R0?qs=jCA%252BPfw4LHbfEJl0sZ31oA%3D%3D
D2-D4 = LED_Green_GullWing: LED Gull-wing SMD High-intensity Green 450mcd 574nm; Manufacturer 1: Ligitek; Manufacturer Part Number 1: L8UG9033/TR1; Ratings: 450 mcd; 574 nm; Material: AlGaInP; SCDType: source; Package / Case: 4.6mm Gull-Wing; Color: Green
H1 = ST-Link: ST-Link header with silkscreen
R1-R5 R10 R12 R48 = Res1: Resistor; Published: 8-Jun-2000; LatestRevisionDate: 17-Jul-2002; LatestRevisionNote: Re-released for DXP Platform.; PackageReference: AXIAL-0.3; Publisher: Altium Limited; PackageDescription: Axial Device, Thru-Hole; 2 Leads; 0.3 in Pin Spacing
RN1 = RES_NET
RST = SW_THT_PB_4.3mm: as RST1 on sheet ADC; Package / Case: 6.5x6.5mm; 4.3mm stem; Material: Brass/Nylon/Ag plating
U1 = STM32F405RE: STM32F405RE 64 pin package, Cortex M4 core with up to
U3 = SN65HVD234-Q1: 3.3V CAN bus transceiver up to 1Mbps
U20 = PESD1CAN,215: ESD protection for CAN bus. Clamp voltage is 40V
UART1 = Header4P: Header 4-pin
USB1 = USB_Type_C: ComponentLink1Description: Datasheet; ComponentLink1URL: https://lcsc.com/product-detail/USB-Type-C_Korean-Hroparts-Elec-TYPE-C-31-M-12_C165948.html
X1 = ASE-8.000MHZ-LC-T: 8MHz; ComponentLink1Description: Datasheet; ComponentLink1URL: https://www.mouser.hk/ProductDetail/ABRACON/ASE-8000MHZ-LC-T?qs=ShQ8XZQtgRsRMJ3lmGY0Sw%3D%3D

## Nets that join several sheets
3V3D: top (6 pins), Power (C50.2 L6.2 R20.1), STM32F405 (23 pins)
5VA: top (L3.4), ADC (L2.4 L9.1 L10.2 R34.2), DAC (C68.1 L7.1 U13.5), Power (C45.2 U7.2 U7.4)
5VD: Power (6 pins), STM32F405 (D1.K)
10VA: ADC (16 pins), DAC (C52.1 U12.4), Power (8 pins)
24VA: ADC (C53.2 C54.2 F1.1 F2.1), DAC (C59.2 F3.1), Power (9 pins)
AGND: top (L3.3), ADC (57 pins), DAC (18 pins), Power (16 pins)
DGND: top (6 pins), Power (7 pins), STM32F405 (30 pins)
DAC_DIN: top (U11.14), DAC (U13.8)
DAC_SCLK: top (U11.13), DAC (U13.9)
DAC_SYNC: top (U11.12), DAC (U13.10)
NetU6_1: top (U10.12), ADC (U6.1)
NetU6_36: top (U10.11), ADC (U6.36)
NetU6_37: top (U10.13), ADC (U6.37)
NetU6_38: top (U10.14), ADC (U6.38)
SPI1_CS: top (U11.3), STM32F405 (U1.24)
SPI1_MOSI: top (U11.5), STM32F405 (U1.23)
SPI1_SCK: top (U11.4), STM32F405 (U1.21)
SPI3_CS: top (U10.3), STM32F405 (U1.54)
SPI3_MISO: top (U10.6), STM32F405 (U1.52)
SPI3_MOSI: top (U10.5), STM32F405 (U1.53)
SPI3_SCK: top (U10.4), STM32F405 (U1.51)